# EAGLE schematic motherboard (EAGLE 6.2)
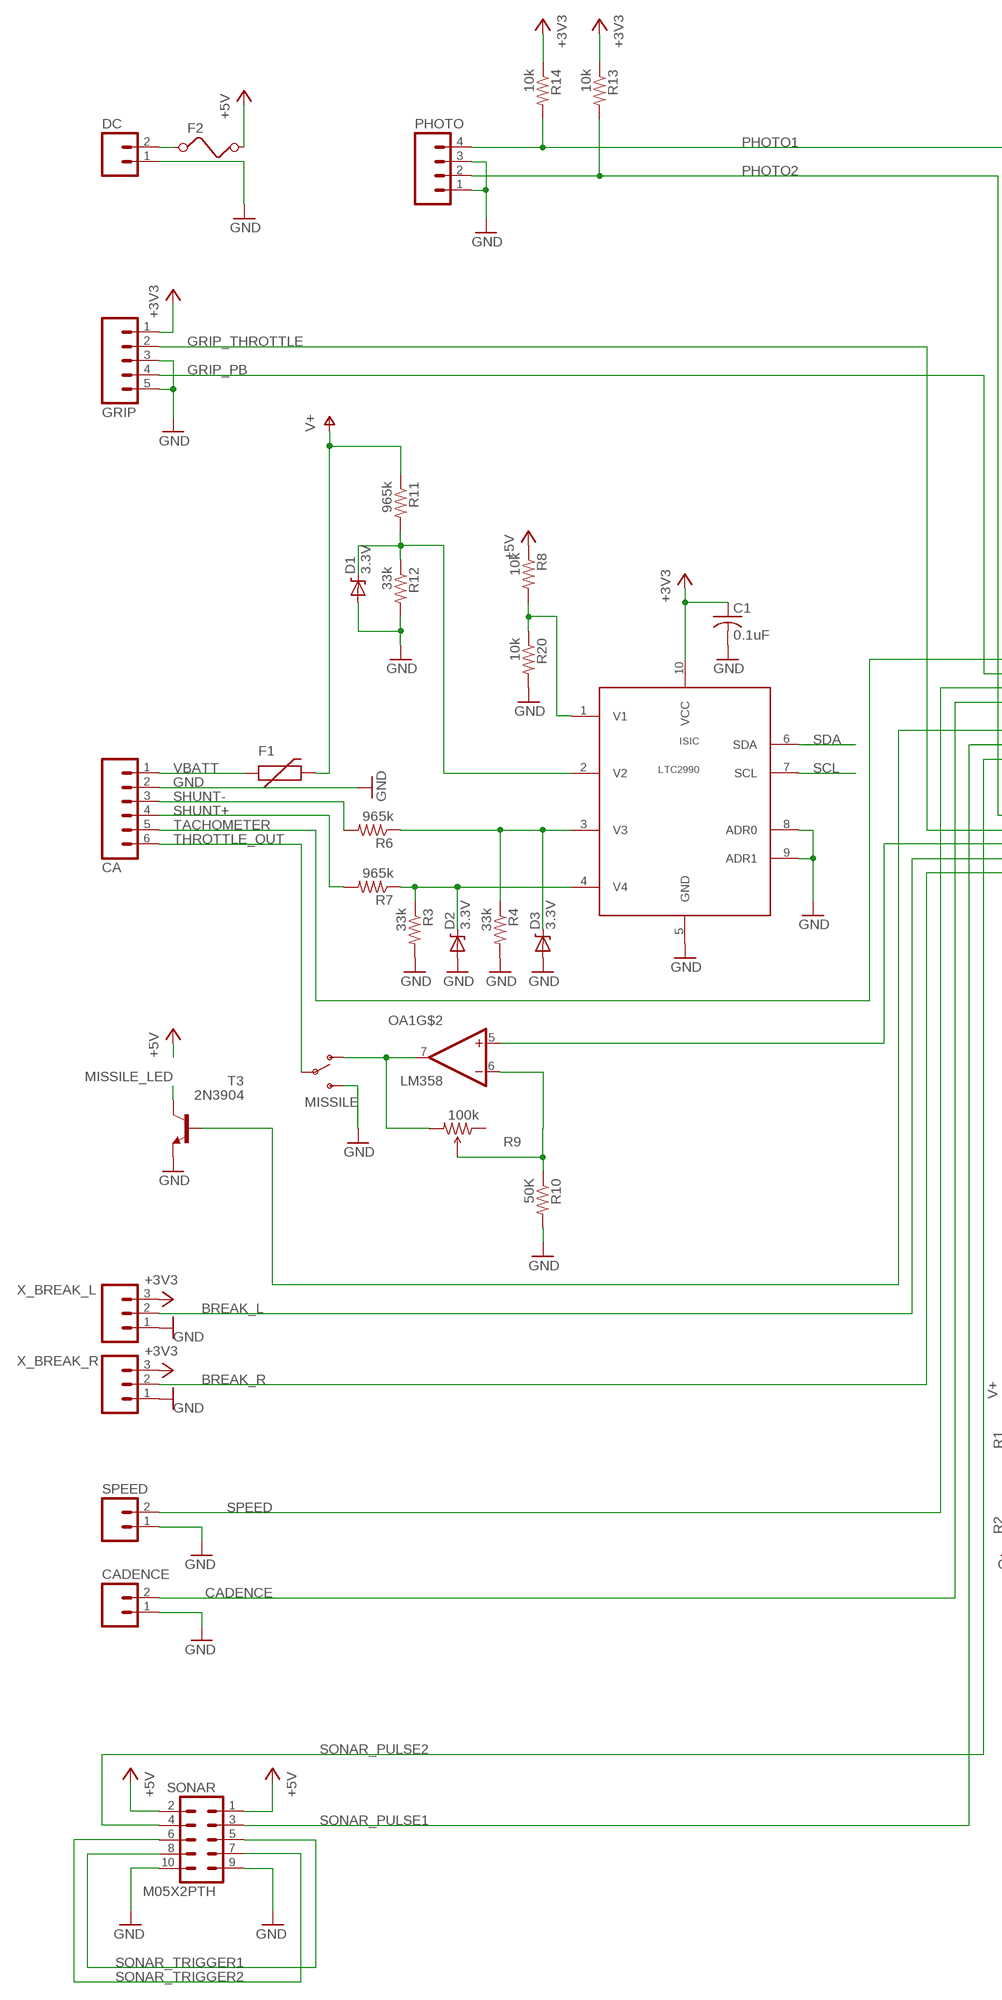
[diagram p0: schematic, sheet 1, part 1 of 2]
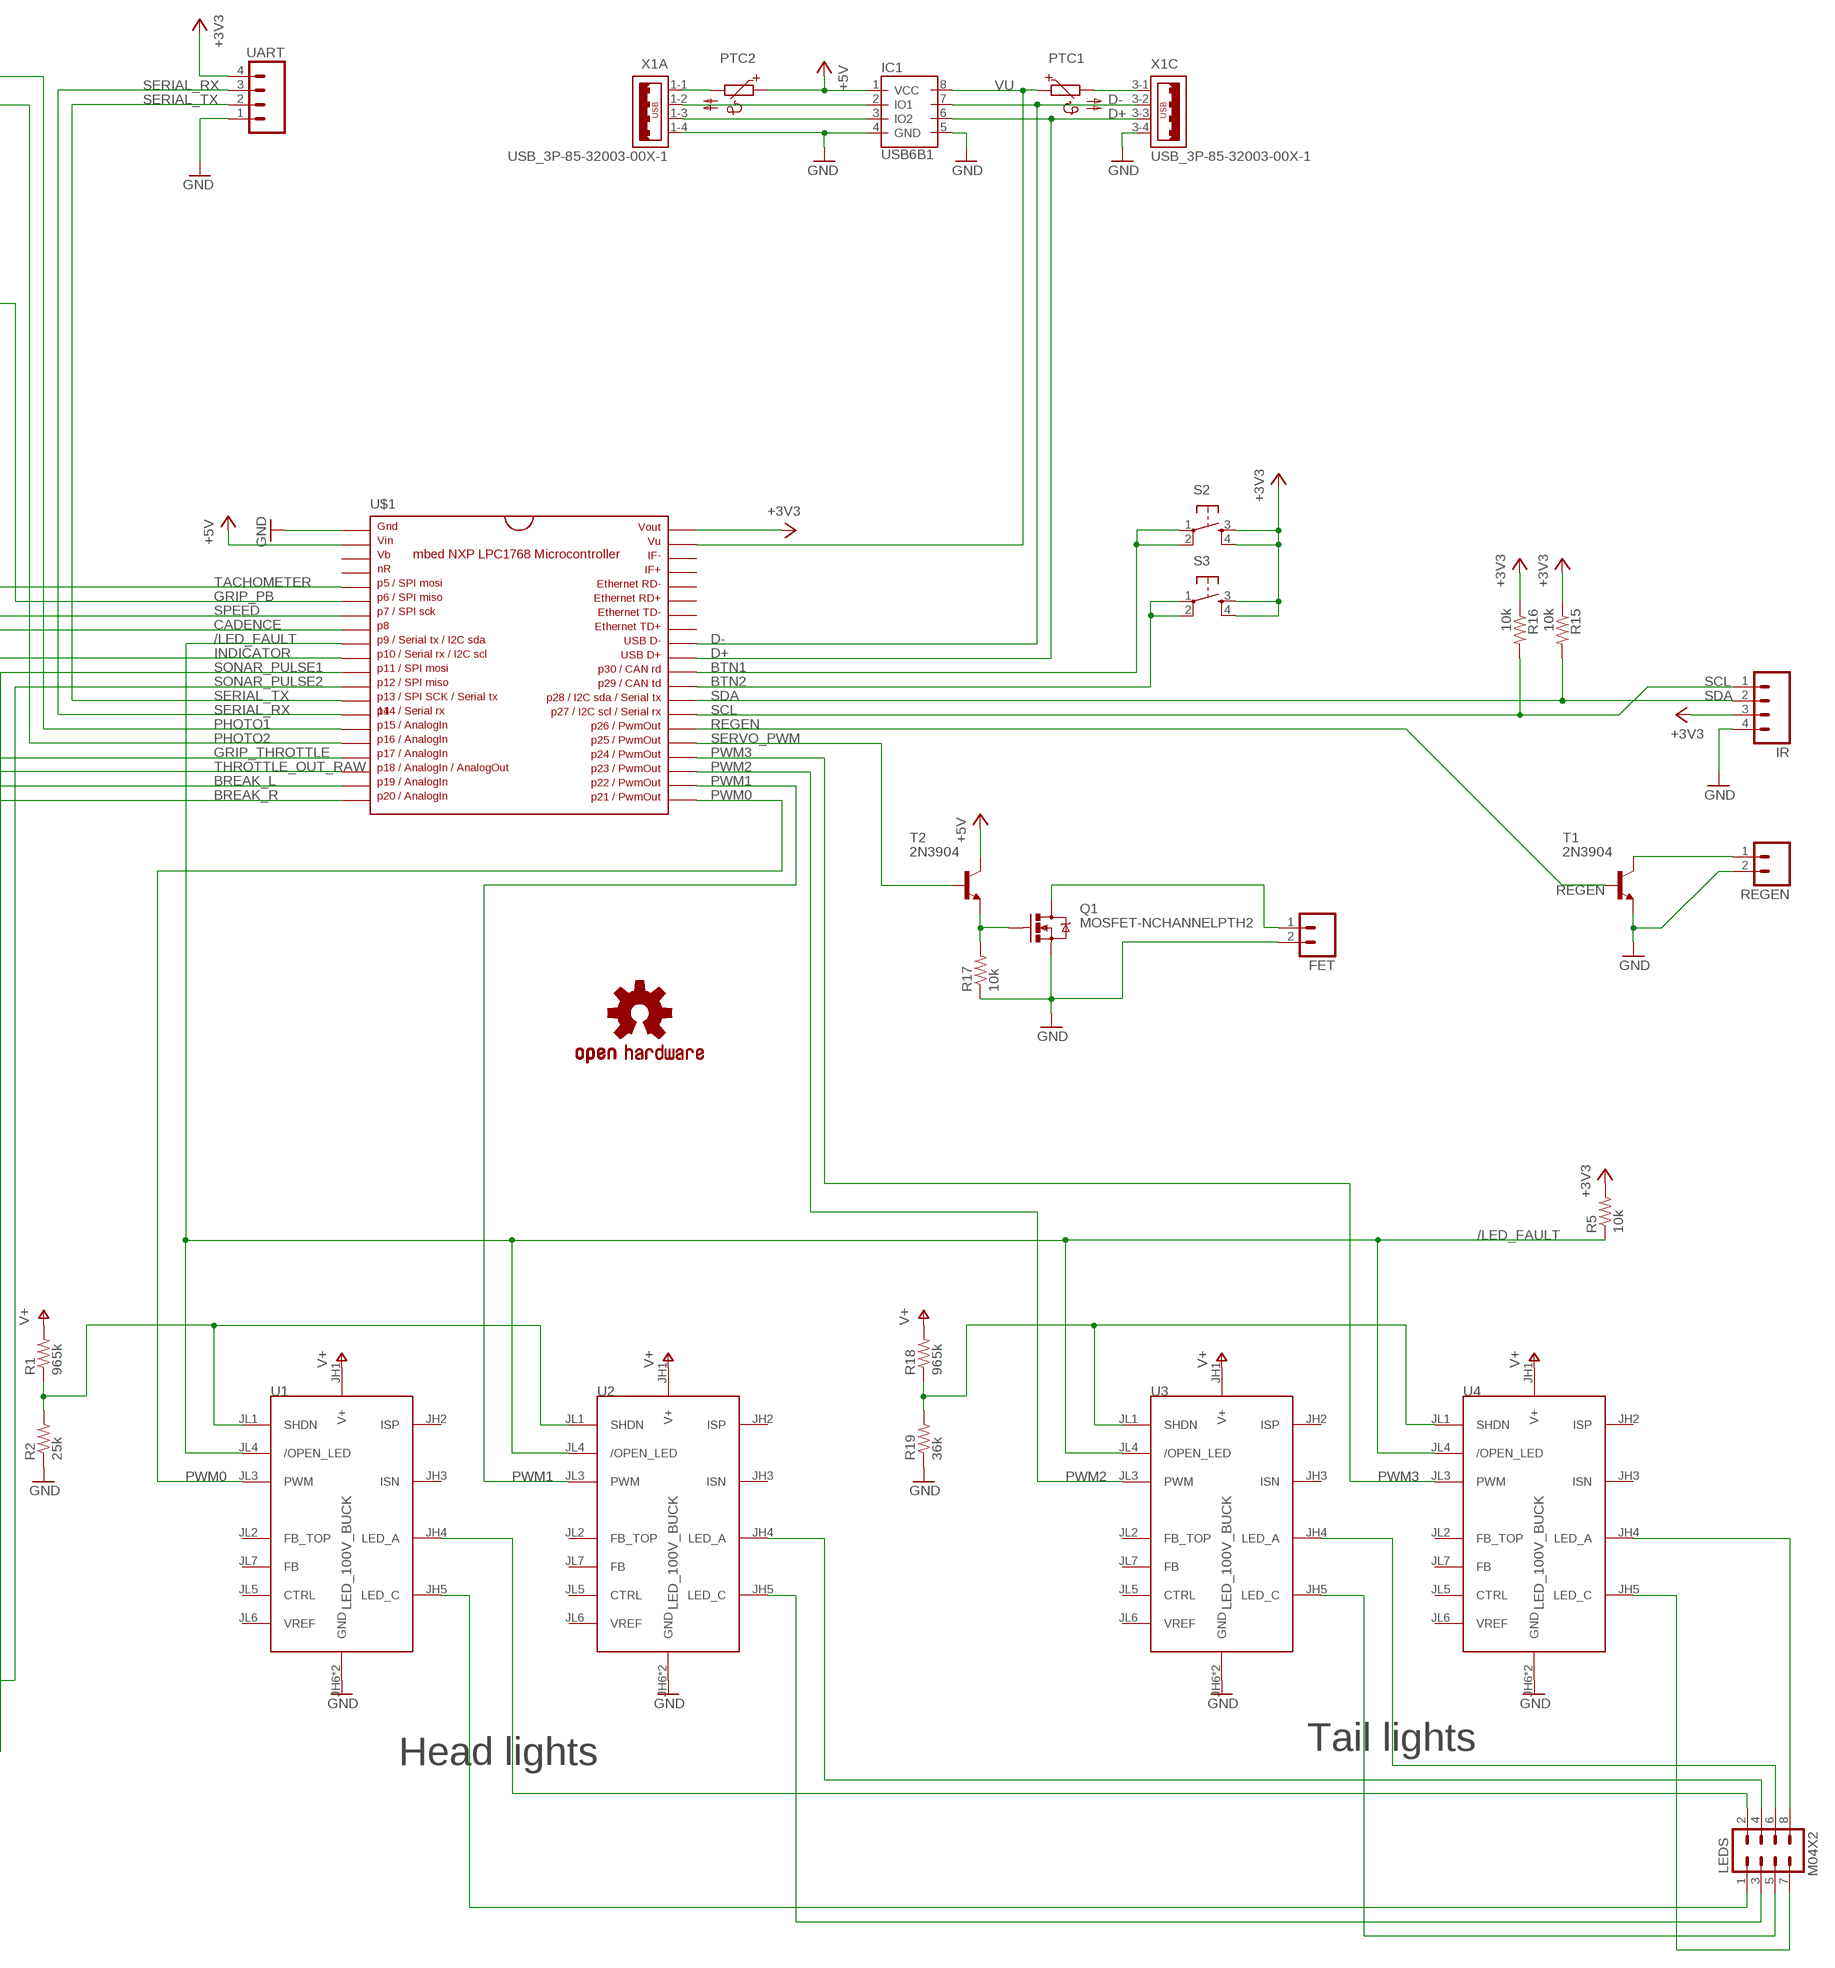
[diagram p1: schematic, sheet 1, part 2 of 2]

## Parts
C1  0.1uF  C-US050-025X075  [C050-025X075]
CA  M06  [06P]
CADENCE  M02JST-PTH-2-KIT  [JST-2-PTH-KIT]
D1  3.3V  DIODE-ZENERPTH  [DIODE-ZENER]
D2  3.3V  DIODE-ZENERPTH  [DIODE-ZENER]
D3  3.3V  DIODE-ZENERPTH  [DIODE-ZENER]
DC  M02JST-PTH-2-KIT  [JST-2-PTH-KIT]
F1  PTCPTH  [PTC]
F2  FUSE  [FUSE]
FET  M02JST-PTH-2-KIT  [JST-2-PTH-KIT]
GRIP  M05  [05P]
IC1  USB6B1  [SO08]
IR  M04  [04P]
ISIC  LTC2990  [MSOP10]
LEDS  M04X2  [2X4]
MISSILE  SWITCH-SPDTPTH  [SWITCH-SPDT]
OA1  LM358  [DIP08]
PHOTO  M04JST-PTH  [JST-4-PTH]
PTC1  PTC679  [P679]
PTC2  PTC679  [P679]
Q1  MOSFET-NCHANNELPTH2  [TO220V]
R1  965k  R-US_0204/5  [0204/5]
R2  25k  R-US_0204/5  [0204/5]
R3  33k  R-US_0204/5  [0204/5]
R4  33k  R-US_0204/5  [0204/5]
R5  10k  R-US_0204/5  [0204/5]
R6  965k  R-US_0204/5  [0204/5]
R7  965k  R-US_0204/5  [0204/5]
R8  10k  R-US_0204/5  [0204/5]
R9  100k  TRIMPOT3362U-2  [3362U-2]
R10  50K  R-US_0204/5  [0204/5]
R11  965k  R-US_0204/5  [0204/5]
R12  33k  R-US_0204/5  [0204/5]
R13  10k  R-US_0204/5  [0204/5]
R14  10k  R-US_0204/5  [0204/5]
R15  10k  R-US_0204/5  [0204/5]
R16  10k  R-US_0204/5  [0204/5]
R17  10k  R-US_0204/5  [0204/5]
R18  965k  R-US_0204/5  [0204/5]
R19  36k  R-US_0204/5  [0204/5]
R20  10k  R-US_0204/5  [0204/5]
REGEN  M02JST-PTH-2-KIT  [JST-2-PTH-KIT]
S2  TAC_SWITCHPTH  [TACTILE-PTH]
S3  TAC_SWITCHPTH  [TACTILE-PTH]
SONAR  M05X2PTH  [AVR_ICSP]
SPEED  M02JST-PTH-2-KIT  [JST-2-PTH-KIT]
T1  2N3904  [TO92]
T2  2N3904  [TO92]
T3  2N3904  [TO92]
U1  LED_100V_BUCK  [LED_100V_BUCK]
U2  LED_100V_BUCK  [LED_100V_BUCK]
U3  LED_100V_BUCK  [LED_100V_BUCK]
U4  LED_100V_BUCK  [LED_100V_BUCK]
U$1  MBED_NXP_LPC1768  [DIL40_0.9]
U$2  OSHW-LOGOL  [OSHW-LOGO-L]
UART  M04JST-PTH  [JST-4-PTH]
X1  USB_3P-85-32003-00X-1  [85-32003-00X-1]
X_BREAK_L  M03JST-PTH  [JST-3-PTH]
X_BREAK_R  M03JST-PTH  [JST-3-PTH]

## Nets
+3V3: C1.1 GRIP.1 IR.3 ISIC.10(VCC) R5.2 R13.1 R14.1 R15.1 R16.1 S2.3 S2.4 S3.3 S3.4 U$1.40 UART.4 X_BREAK_L.3 X_BREAK_R.3
+5V: F2.2 IC1.1(VCC) PTC2.1 R8.1 SONAR.1 SONAR.2 T2.1(C) U$1.2
/LED_FAULT: R5.1 U1.JL4(/OPEN_LED) U2.JL4(/OPEN_LED) U3.JL4(/OPEN_LED) U4.JL4(/OPEN_LED) U$1.9
BATT_SENSE: D1.P$1(C) ISIC.2(V2) R11.2 R12.1
BREAK_L: U$1.19 X_BREAK_L.2
BREAK_R: U$1.20 X_BREAK_R.2
BTN1: S2.1 S2.2 U$1.30
BTN2: S3.1 S3.2 U$1.29
CADENCE: CADENCE.2 U$1.8
D+: IC1.6(IO2) U$1.31 X1.3-3
D-: IC1.7(IO1) U$1.32 X1.3-2
GND: C1.2 CA.2 CADENCE.1 D1.P$2(A) D2.P$2(A) D3.P$2(A) DC.1 FET.2 GRIP.3 GRIP.5 IC1.4(GND) IC1.5(GND) IR.4 ISIC.5(GND) ISIC.8(ADR0) ISIC.9(ADR1) MISSILE.3(S) PHOTO.1 PHOTO.3 Q1.3(S) R2.1 R3.2 R4.2 R10.2 R12.2 R17.1 R19.1 R20.2 REGEN.2 SONAR.9 SONAR.10 SPEED.1 T1.3(E) T3.3(E) U1.JH6(GND) U1.JL8(GND) U2.JH6(GND) U2.JL8(GND) U3.JH6(GND) U3.JL8(GND) U4.JH6(GND) U4.JL8(GND) U$1.1 UART.1 X1.1-4 X1.3-4 X_BREAK_L.1 X_BREAK_R.1
GRIP_PB: GRIP.4
GRIP_THROTTLE: GRIP.2 U$1.17
INDICATOR: T3.2(B) U$1.10
MISSILE_LED: T3.1(C)
N$1: PTC1.2 X1.3-1
N$2: LEDS.1 U1.JH5(LED_C)
N$3: LEDS.3 U2.JH5(LED_C)
N$4: LEDS.5 U3.JH5(LED_C)
N$5: LEDS.7 U4.JH5(LED_C)
N$6: LEDS.2 U1.JH4(LED_A)
N$7: LEDS.4 U2.JH4(LED_A)
N$8: LEDS.6 U3.JH4(LED_A)
N$9: LEDS.8 U4.JH4(LED_A)
N$10: R1.1 R2.2 U1.JL1(SHDN) U2.JL1(SHDN)
N$11: R18.1 R19.2 U3.JL1(SHDN) U4.JL1(SHDN)
N$12: D3.P$1(C) ISIC.3(V3) R4.1 R6.1
N$13: IC1.2(IO1) X1.1-2
N$14: Q1.1(G) R17.2 T2.3(E)
N$15: PTC2.2 X1.1-1
N$16: IC1.3(IO2) X1.1-3
N$17: D2.P$1(C) ISIC.4(V4) R3.1 R7.1
N$18: R9.2(WIPER) R10.1
N$19: MISSILE.1(O) OA1.7(OUT) R9.3(CW)
N$20: OA1.6(-IN)
N$21: ISIC.1(V1) R8.2 R20.1
N$24: DC.2 F2.1
N$25: REGEN.1 T1.1(C)
N$26: FET.1 Q1.2(D)
PHOTO1: PHOTO.4 R14.2 U$1.15
PHOTO2: PHOTO.2 R13.2 U$1.16
PWM0: U1.JL3(PWM) U$1.21
PWM1: U2.JL3(PWM) U$1.22
PWM2: U3.JL3(PWM) U$1.23
PWM3: U4.JL3(PWM) U$1.24
REGEN: T1.2(B) U$1.26
SCL: IR.1 ISIC.7(SCL) R16.2 U$1.27
SDA: IR.2 ISIC.6(SDA) R15.2 U$1.28
SERIAL_RX: U$1.14 UART.3
SERIAL_TX: U$1.13 UART.2
SERVO_PWM: T2.2(B) U$1.25
SHUNT+: CA.4 R7.2
SHUNT-: CA.3 R6.2
SONAR_PULSE1: SONAR.3 U$1.11
SONAR_PULSE2: SONAR.4 U$1.12
SONAR_TRIGGER1: SONAR.5 SONAR.8
SONAR_TRIGGER2: SONAR.6 SONAR.7
SPEED: SPEED.2 U$1.7
TACHOMETER: CA.5
THROTTLE_OUT: CA.6 MISSILE.2(P)
THROTTLE_OUT_RAW: OA1.5(+IN) U$1.18
V+: F1.P$2 R1.2 R11.1 R18.2 U1.JH1(V+) U2.JH1(V+) U3.JH1(V+) U4.JH1(V+)
VBATT: CA.1 F1.P$1
VU: IC1.8(VCC) PTC1.1 U$1.39
Unconnected: OA1.1(OUT) OA1.2(-IN) OA1.3(+IN) R9.1(CCW) U1.JH2(ISP) U1.JH3(ISN) U1.JL2(FB_TOP) U1.JL5(CTRL) U1.JL6(VREF) U1.JL7(FB) U2.JH2(ISP) U2.JH3(ISN) U2.JL2(FB_TOP) U2.JL5(CTRL) U2.JL6(VREF) U2.JL7(FB) U3.JH2(ISP) U3.JH3(ISN) U3.JL2(FB_TOP) U3.JL5(CTRL) U3.JL6(VREF) U3.JL7(FB) U4.JH2(ISP) U4.JH3(ISN) U4.JL2(FB_TOP) U4.JL5(CTRL) U4.JL6(VREF) U4.JL7(FB) U$1.3 U$1.4 U$1.5 U$1.6 U$1.33 U$1.34 U$1.35 U$1.36 U$1.37 U$1.38 X1.2-1 X1.2-2 X1.2-3 X1.2-4

## Notes on the sheet
- Tail lights
- Head lights

## Power pins joined to a net without a drawn wire
V+: OA1.8(V+)
V-: OA1.4(V-)

## Library data of the parts
C1 = rcl:C-US: CAPACITOR, American symbol
CA = con-amp-quick:M06: AMP QUICK CONNECTOR; OC_FARNELL: unknown; OC_NEWARK: unknown
CADENCE DC FET REGEN SPEED = SparkFun-Connectors:M02: Header 2 Standard 2-pin 0.1" header. Use with straight break away headers (SKU : PRT-00116), right angle break away headers (PRT-00553), swiss pins (PRT-00743), machine pins (PRT-00117), and female headers (PRT-00115). Molex polarized connector foot print use with SKU : PRT-08233 with associated crimp pins and housings.
D1-D3 = SparkFun-DiscreteSemi:DIODE-ZENER: Zener Diode Production Part - 8199 3.4V Zener Voltage
F1 = SparkFun-PowerIC:PTC: Resettable Fuse PTC Resettable Fuse. Spark Fun Electronics SKU : COM-08357
F2 = special:FUSE: FUSE 5 x 20 mm
GRIP = con-amp-quick:M05: AMP QUICK CONNECTOR; OC_FARNELL: unknown; OC_NEWARK: unknown
IC1 = st-microelectronics:USB6B1: DATA LINES PROTECTION Source: http://www.st.com/stonline/products/literature/ds/5605.pdf; MPN: USB6B1; OC_FARNELL: 9804358; OC_NEWARK: 26M4750
IR = con-amp-quick:M04: AMP QUICK CONNECTOR; OC_FARNELL: unknown; OC_NEWARK: unknown
ISIC = droidcycle:LTC2990: Quad I2C Voltage, Current and Temperature Monitor The LTC®2990 is used to monitor system temperatures, voltages and currents. Through the I2C serial interface, the device can be configured to measure many combi- nations of internal temperature, remote temperature, remote voltage, remote current and internal VCC. The internal 10ppm/°C reference minimizes the number of supporting components and area required. Selectable address and configurable functionality give the LTC2990 flexibility to be incorporated in various systems needing temperature, voltage or current data. The LTC2990 fits well in systems needing sub-millivolt voltage resolution, 1% current measurement and 1°C temperature accuracy or any combination of the three.
LEDS = SparkFun-Connectors:M04X2: .1" header, two rows of four.
MISSILE = SparkFun-Electromechanical:SWITCH-SPDT: SPST Switch Simple slide switch. Spark Fun Electronics SKU : COM-00102
OA1 = SparkFun-AnalogIC:LM358: Jellybean op-amp
PHOTO UART = SparkFun-Connectors:M04: Header 4 Standard 4-pin 0.1" header. Use with straight break away headers (SKU : PRT-00116), right angle break away headers (PRT-00553), swiss pins (PRT-00743), machine pins (PRT-00117), and female headers (PRT-00115). Molex polarized connector foot print use with SKU : PRT-08231 with associated crimp pins and housings. 1MM SMD Version SKU: PRT-10208
PTC1 PTC2 = ptc-ntc:PTC679: PHILIPS PTC; OC_FARNELL: unknown; OC_NEWARK: unknown
Q1 = SparkFun-DiscreteSemi:MOSFET-NCHANNEL: Generic NMOS footprint
R1-R8 R10-R20 = rcl:R-US_: RESISTOR, American symbol
R9 = SparkFun-Electromechanical:TRIMPOT: Various small potentiometers for "set-and-forget" applications
S2 S3 = SparkFun-Electromechanical:TAC_SWITCH: Momentary Switch Button commonly used for reset or general input. Spark Fun Electronics SKU : COM-00097
SONAR = SparkFun-Connectors:M05X2: Header 5x2 Standard 10-pin dual row 0.1" header. Commonly used with AVR-ISP. Use with Spark Fun Electronics SKU: PRT-00778
T1-T3 = transistor:2N3904: NPN TRANSISTOR
U1-U4 = LED-drivers:LED_100V_BUCK: 100V LED buck driver DC Labs 100V in / 100V out led buck driver daughter board.
U$1 = SparkFun-DigitalIC:MBED_NXP_LPC1768
U$2 = SparkFun-Aesthetics:OSHW-LOGO: Open Source Hardware Logo This logo indicates the piece of hardware it is found on incorporates a OSHW license and/or adheres to the definition of open source hardware found here: http://freedomdefined.org/OSHW
X1 = con-cypressindustries:USB_3P-: Triple USB Connector Source: www.cypressindustries.com; OC_FARNELL: unknown; OC_NEWARK: unknown
X_BREAK_L X_BREAK_R = SparkFun-Connectors:M03: Header 3 Standard 3-pin 0.1" header. Use with straight break away headers (SKU : PRT-00116), right angle break away headers (PRT-00553), swiss pins (PRT-00743), machine pins (PRT-00117), and female headers (PRT-00115). Molex polarized connector foot print use with SKU : PRT-08232 with associated crimp pins and housings.